# EAGLE design TicTocTrac_bottom_v1.0 (EAGLE 6.1)
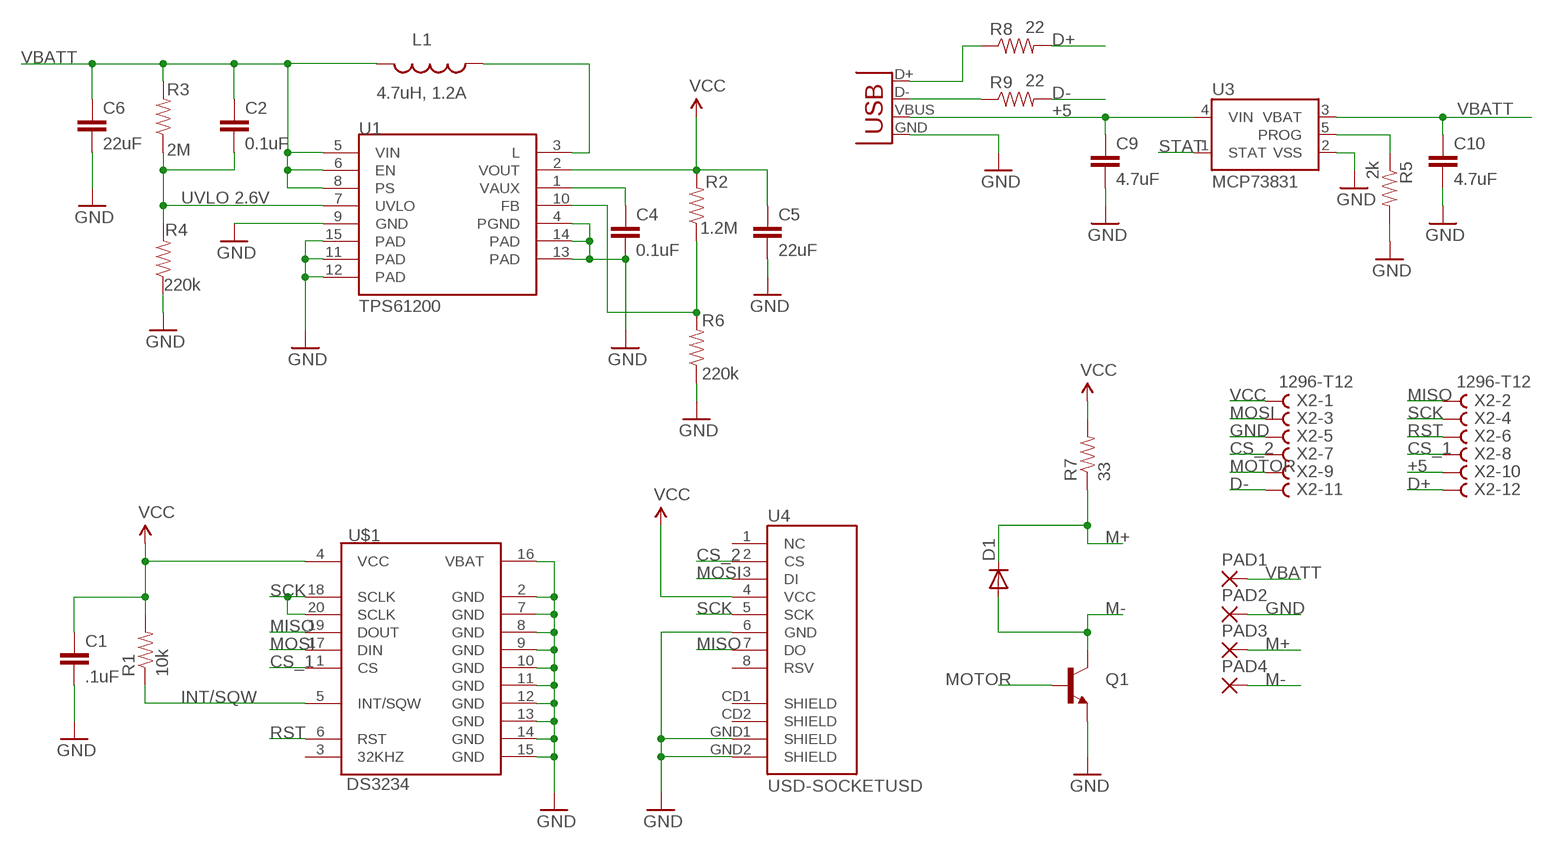
[diagram p0: schematic, sheet 1]

## Parts
C1  .1uF  CAP0402-CAP  [0402-CAP]
C2  0.1uF  CAP0402-CAP  [0402-CAP]
C4  0.1uF  CAP0402-CAP  [0402-CAP]
C5  22uF  CAP0805  [0805]
C6  22uF  CAP0805  [0805]
C9  4.7uF  CAP0402-CAP  [0402-CAP]
C10  4.7uF  CAP0402-CAP  [0402-CAP]
D1  DIODESOD  [SOD-323]
L1  4.7uH, 1.2A  INDUCTOR.  [CDRH2D09]
PAD1  1,6/0,8  [1,6/0,8]
PAD2  1,6/0,8  [1,6/0,8]
PAD3  1,6/0,8  [1,6/0,8]
PAD4  1,6/0,8  [1,6/0,8]
Q1  TRANSISTOR_NPNSOT23  [SOT23]
R1  10k  RESISTOR0402-RES  [0402-RES]
R2  1.2M  RESISTOR0402-RES  [0402-RES]
R3  2M  RESISTOR0402-RES  [0402-RES]
R4  220k  RESISTOR0402-RES  [0402-RES]
R5  2k  RESISTOR0402-RES  [0402-RES]
R6  220k  RESISTOR0402-RES  [0402-RES]
R7  33  RESISTOR0805-RES  [0805]
R8  22  RESISTOR0402-RES  [0402-RES]
R9  22  RESISTOR0402-RES  [0402-RES]
U1  TPS61200  [QFN-10_PAD]
U3  MCP73831  [SOT23-5]
U4  USD-SOCKETUSD  [USD-SOCKET-PP]
U$1  DS3234  [DS3234]
X1  USB-MICROB  [USB-MICROB]
X2  1296-T12  [1296-12]

## Nets
3.3V: R2.1 R6.2 U1.10(FB)
+5: C9.1 U3.4(VIN) X1.VBUS X2.10
CS_1: U$1.1(CS) X2.8
CS_2: U4.2(CS) X2.7
D+: R8.2 X2.12
D-: R9.2 X2.11
GND: C1.2 C4.2 C5.2 C6.2 C9.2 C10.2 PAD2.1(P) Q1.2(E) R4.1 R5.2 R6.1 U1.4(PGND) U1.11(PAD) U1.12(PAD) U1.13(PAD) U1.14(PAD) U1.15(PAD) U3.2(VSS) U4.6(GND) U4.GND1(SHIELD) U4.GND2(SHIELD) U$1.2(GND) U$1.7(GND) U$1.8(GND) U$1.9(GND) U$1.10(GND) U$1.11(GND) U$1.12(GND) U$1.13(GND) U$1.14(GND) U$1.15(GND) U$1.16(VBAT) X1.GND X2.5
INT/SQW: R1.1 U$1.5(INT/SQW)
M+: D1.1(C) PAD3.1(P) R7.1
M-: D1.2(A) PAD4.1(P) Q1.3(C)
MISO: U4.7(DO) U$1.19(DOUT) X2.2
MOSI: U4.3(DI) U$1.17(DIN) X2.3
MOTOR: Q1.1(B) X2.9
N$1: C4.1 U1.1(VAUX)
N$2: L1.P$1 U1.3(L)
N$7: R9.1 X1.D-
N$9: R8.1 X1.D+
N$11: R5.1 U3.5(PROG)
RST: U$1.6(RST) X2.6
SCK: U4.5(SCK) U$1.18(SCLK) U$1.20(SCLK) X2.4
STAT: U3.1(STAT)
UVLO: C2.2 R3.1 R4.2 U1.7(UVLO)
VBATT: C2.1 C6.1 C10.1 L1.P$2 PAD1.1(P) R3.2 U1.5(VIN) U1.6(EN) U1.8(PS) U3.3(VBAT)
VCC: C1.1 C5.1 R1.2 R2.2 R7.2 U1.2(VOUT) U4.4(VCC) U$1.4(VCC) X2.1
Unconnected: U1.9(GND) U4.1(NC) U4.8(RSV) U4.CD1(SHIELD) U4.CD2(SHIELD) U$1.3(32KHZ)

## Notes on the sheet
- UVLO 2.6V

## Library data of the parts
C1 C2 C4 C5 C9 C10 = SparkFun:CAP: Capacitor Standard 0603 ceramic capacitor, and 0.1" leaded capacitor.
C6 = SparkFun-Passives:CAP: Capacitor Standard 0603 ceramic capacitor, and 0.1" leaded capacitor.
D1 = SparkFun:DIODE: Diode These are standard reverse protection diodes and small signal diodes. SMA package can handle up to about 1A. SOD-323 can handle about 200mA. What the SOD-323 package when ordering, there are some mfgs out there that are 5-pin packages.
L1 = SparkFun:INDUCTOR: Inductors Basic Inductor/Choke - 0603 and 1206. Footprints are not proven and vary greatly between part numbers.
PAD1-PAD4 = wirepad:1,6/0,8: THROUGH-HOLE PAD
Q1 = SparkFun:TRANSISTOR_NPN: Transistor NPN BJT configuration in SOT23 package. MMBT2222 is the common NPN we use. Double check BCE configuration again layout.
R1-R9 = SparkFun:RESISTOR: Resistor Basic schematic elements and footprints for 0603, 1206, and PTH resistors.
U1 = SparkFun:TPS61200: DC to DC Booster
U3 = SparkFun:MCP73831: Microchip's MCP73831 Miniature single cell, fully integrated Li-Ion, Li-polymer charge management controller http://ww1.microchip.com/downloads/en/DeviceDoc/21984a.pdf
U4 = tictoc:USD-SOCKET: microSD Socket Push-push type uSD socket. Schematic element and footprint production proven. Spark Fun Electronics SKU : PRT-00127.
U$1 = SparkFun:DS3234: DS3234 Real Time Clock
X1 = SparkFun:USB: USB Connectors USB-B-PTH is fully proven SKU : PRT-00139 USB-miniB is fully proven SKU : PRT-00587 USB-A-PCB is untested. USB-A-H is throughly reviewed, but untested. Spark Fun Electronics SKU : PRT-00437 USB-B-SMT is throughly reviewed, but untested. Needs silkscreen touching up. USB-A-S has not been used/tested USB-MB-H has not been used/tested
X2 = con-leotronics:1296-T12: 1.27mm SINGLE ROW FEMALE SOCKET Source: http://www.leotronics.co.uk/Conexcon/Data%20Sheets/sec.%20A/1296ing.pdf; OC_FARNELL: unknown; OC_NEWARK: unknown

## Board
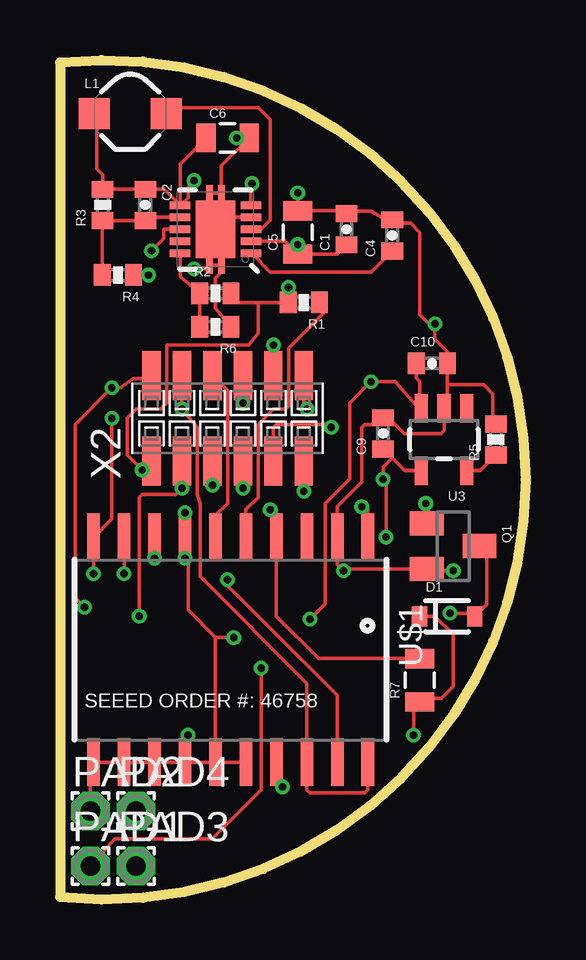
[diagram p1: board, top side]
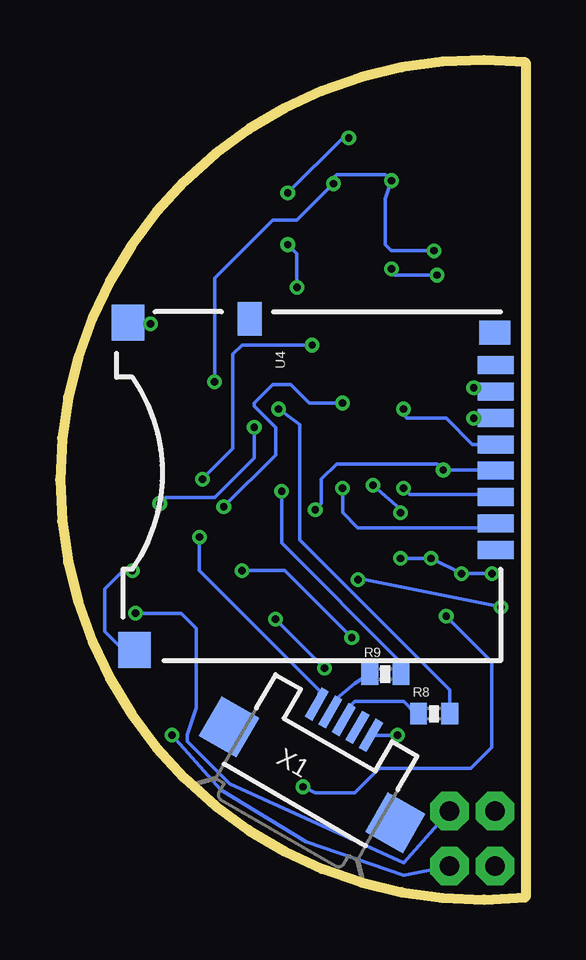
[diagram p2: board, bottom side, seen from below]

Size 19.4 x 35 mm. Coordinates in mm from the lower left corner, seen from the top.
Outline: 0,34.9 0,0.1 arc192 0,34.9
Copper layers (1*16): Top 0.035mm / dielectric 1.5mm / Bottom 0.035mm
Design rules: minimum track width 6mil, minimum drill 12mil, track to track 6mil, track to pad 6mil, pad to pad 6mil, via to via 6mil, smd to smd 0mil, copper to edge 10mil, drill to drill 10mil, minimum pad ring 10mil, minimum via ring 6mil, stop-mask expansion 2mil, vias tented up to drill 100mil, thermal gap 10mil

### Footprints (pad centres in the part's own frame; a part is rotated, then mirrored left to right if it is on the bottom)
0402-CAP = smd 0.7 x 0.9: 1 -0.65,0; 2 0.65,0
0805 = smd 0.8 x 1.2: 1 -0.9,0; 2 0.9,0
SOD-323 = smd 0.63 x 0.83: 1 -1.15,0; 2 1.15,0
CDRH2D09 = smd 1.3 x 1.3: P$1 -1.5,0; P$2 1.5,0
1,6/0,8 = drill 0.813 pad 1.6 octagon: 1 0,0
SOT23 = smd 1 x 1.4: 1 -0.95,-1.1; 2 0.95,-1.1; 3 0,1.1
0402-RES = smd 0.7 x 0.9: 1 -0.65,0; 2 0.65,0
QFN-10_PAD = smd 0.297 x 0.85: 1 -1,-1.475; 2 -0.5,-1.475; 3 0,-1.475; 4 0.5,-1.475; 5 1,-1.475; 6 1,1.475; 7 0.5,1.475; 8 0,1.475; 9 -0.5,1.475; 10 -1,1.475 | smd 0.7 x 0.28: 11 -1.5,0.25; 12 -1.5,-0.25; 13 1.5,0.25; 14 1.5,-0.25 | smd 2.4 x 1.65: 15 0,0
SOT23-5 = smd 0.55 x 1.2: 1 -0.95,-1.3; 2 0,-1.3; 3 0.95,-1.3; 4 0.95,1.3; 5 -0.95,1.3
USD-SOCKET-PP = smd 0.75 x 1.5: 1 3.2,7.91; 2 2.1,7.91; 3 1,7.91; 4 -0.1,7.91; 5 -1.2,7.91; 6 -2.3,7.91; 7 -3.4,7.91; 8 -4.5,7.91 | smd 1 x 1.3: CD1 -5.85,7.86 | smd 1.4 x 1: CD2 -6.425,-2.35 | smd 1.5 x 1.35: GND1 -6.275,-7.415; GND2 7.375,-7.145
DS3234 = smd 0.53 x 1.98: 1 -5.715,-4.685; 2 -4.445,-4.685; 3 -3.175,-4.685; 4 -1.905,-4.685; 5 -0.635,-4.685; 6 0.635,-4.685; 7 1.905,-4.685; 8 3.175,-4.685; 9 4.445,-4.685; 10 5.715,-4.685; 11 5.715,4.685; 12 4.445,4.685; 13 3.175,4.685; 14 1.905,4.685; 15 0.635,4.685; 16 -0.635,4.685; 17 -1.905,4.685; 18 -3.175,4.685; 19 -4.445,4.685; 20 -5.715,4.685
USB-MICROB = smd 0.35 x 1.4: D+ 0,2.65; D- -0.65,2.65; GND 1.3,2.65; ID 0.65,2.65; VBUS -1.3,2.65 | smd 1.8 x 1.9: MT1 -4,0; MT2 4,0
1296-12 = smd 0.76 x 2.05: 1 -3.175,-1.78; 2 -3.175,1.78; 3 -1.905,-1.78; 4 -1.905,1.78; 5 -0.635,-1.78; 6 -0.635,1.78; 7 0.635,-1.78; 8 0.635,1.78; 9 1.905,-1.78; 10 1.905,1.78; 11 3.175,-1.78; 12 3.175,1.78

### Placement (x,y rotation side)
C1  11.94,27.94 90 top
C2  3.56,28.96 270 top
C4  13.84,27.69 90 top
C5  9.91,27.81 90 top
C6  6.98,31.75 0 top
C9  13.46,19.43 90 top
C10  15.49,22.35 0 top
D1  16.13,11.81 0 top
L1  2.92,32.77 180 top
PAD1  1.27,1.4 0 top
PAD2  1.27,3.68 0 top
PAD3  3.18,1.4 0 top
PAD4  3.18,3.68 0 top
Q1  16.38,14.73 270 top
R1  10.16,24.89 180 top
R2  6.48,25.27 0 top
R3  1.78,28.96 90 top
R4  2.41,26.04 180 top
R5  18.16,19.18 90 top
R6  6.48,23.88 180 top
R7  14.99,9.14 90 top
R8  3.81,7.75 0 bottom
R9  5.84,9.4 0 bottom
U1  6.48,27.94 90 top
U3  16,19.18 180 top
U4  9.14,17.78 270 bottom
U$1  7.11,10.41 180 top
X1  8.89,5.21 330 bottom
X2  6.98,20.07 0 top

### Tracks (layer width: path | path; a pad name or v marks a point on that pad's centre or on a via)
3.3V
  Top 0.152: R6.2 R2.1 5,25.97 U1.10
+5  (via drill 0.3)
  Top 0.152: U3.4 14.37,17.88 13.84,18.41 | 13.84,18.41 C9.1 | X2.10 v8.89,23.11 | 13.84,18.41 13.46,18.03 v13.46,17.53 13.59,17.4 v13.59,15.11
  Bottom 0.152: v8.89,23.11 11.81,23.11 12.19,22.73 12.19,18.8 v13.46,17.53 | X1.VBUS 8.56,8.69 13.59,13.72 v13.59,15.11
CS_1  (via drill 0.3)
  Top 0.152: X2.8 v7.62,20.7 | v12.57,16.38 12.7,16.38 12.83,16.26 U$1.1
  Bottom 0.152: v7.62,20.7 9.02,20.7 9.78,21.46 10.54,21.46 11.3,20.7 11.3,20.57 10.41,19.69 10.41,18.54 v12.57,16.38
CS_2  (via drill 0.3)
  Top 0.152: X2.7 v7.62,17.15
  Bottom 0.152: v7.62,17.15 7.62,16.13 6.98,15.49 1.43,15.49 U4.2
D+  (via drill 0.3)
  Top 0.152: v10.29,20.45 10.16,20.57 X2.12
  Bottom 0.152: R8.2 3.16,8.75 9.4,14.99 9.4,19.81 v10.29,20.45
D-  (via drill 0.3)
  Top 0.152: v10.16,17.02 X2.11
  Bottom 0.152: R9.2 5.19,9.89 10.16,14.86 v10.16,17.02
GND  (via drill 0.3)
  Top 0.152: C1.2 12.1,28.7 12.95,28.7 13.57,28.34 C4.2 13.98,28.19 14.61,28.19 14.99,27.81 14.99,24.38 15.37,24 v15.62,24 15.62,23.37 16.14,22.85 C10.2 16.14,21.46 | 16.14,21.46 16.14,20.62 U3.2 16,19.56 15.88,19.43 14.35,19.43 13.7,20.08 C9.2 13.21,19.81 12.7,19.81 12.57,19.69 12.57,17.4 11.56,16.38 U$1.2 11.56,13.97 11.75,13.78 | R5.2 18.03,19.95 18.03,21.08 17.65,21.46 16.14,21.46 | 11.75,13.78 Q1.2 15.35,13.72 v16.38,13.72 | U$1.16 U$1.15 | U$1.15 U$1.14 | U$1.14 U$1.13 U$1.12 U$1.11 1.27,5.73 PAD2.1 | v2.16,20.07 2.16,15.86 U$1.10 v1.4,13.59 | R4.1 v3.68,26.04 | v5.59,26.29 6.08,26.29 U1.11 | U$1.15 6.48,10.92 | U$1.7 5.33,14.97 5.33,12.07 6.48,10.92 | U1.14 U1.13 | U1.4 6.98,28.44 | 6.98,28.44 U1.15 6.48,27.56 6.22,27.31 U1.11 | 6.98,28.44 6.98,28.58 6.73,28.83 U1.14 | U1.11 U1.12 6.73,26.16 6.48,25.91 6.48,24.65 R6.1 | U$1.7 v5.21,16.13 | v6.35,17.27 6.48,18.16 X2.5 | 11.75,13.78 v11.81,13.72 | v7.24,10.92 6.48,10.92 | v5.33,6.86 5.21,6.86 U$1.14 | v2.67,13.59 U$1.9 2.67,15.11 | U$1.8 v3.94,14.22 | U$1.7 v5.21,14.22 | C1.2 | U1.14 6.73,30.59 C6.2 7.49,31.75 7.37,31.88 v7.37,31.75 | v9.91,29.46 C5.2 11.94,28.71 C1.2
  Bottom 0.152: U4.GND1 15.67,24.06 v15.62,24 | U4.6 2.14,20.08 v2.16,20.07 | v3.68,26.04 5.46,26.04 v5.59,26.29 | U4.GND2 16.37,10.41 16.38,10.41 16.76,10.41 17.53,11.18 17.53,12.95 16.76,13.72 v16.38,13.72 | v11.81,13.72 10.03,13.72 v7.24,10.92 | X1.GND v5.34,6.85 v5.33,6.86 | v1.4,13.59 v2.67,13.59 v3.94,14.22 v5.21,14.22 | v5.21,16.13 5.21,16.26 v6.35,17.27 | v9.91,29.46 7.62,31.75 v7.37,31.75
INT/SQW
  Top 0.152: R1.1 11.01,24.47 9.52,22.99 9.52,20.57 9.4,20.45 8.89,20.45 8.25,19.81 8.25,16.76 7.75,16.26 U$1.5
M+  (via drill 0.3)
  Top 0.152: D1.1 15.62,11.81 16.38,11.05 16.38,8.89 15.88,8.38 15.22,8.38 R7.1 14.73,7.99 v14.73,6.86
  Bottom 0.152: PAD3.1 5.08,1.02 9.14,2.41 12.7,4.57 v14.73,6.86
M-  (via drill 0.3)
  Top 0.152: Q1.3 17.78,14.44 17.78,12.31 D1.2 17.15,11.94 v16.26,11.94
  Bottom 0.152: v16.26,11.94 14.35,11.94 13.72,11.3 13.72,8 14.1,6.86 14.1,6.6 12.32,4.83 5.08,1.52 PAD4.1
MISO  (via drill 0.3)
  Top 0.152: X2.2 3.68,21.72 3.05,21.72 2.54,21.34 v2.16,21.34 0.64,19.81 0.64,12.57 v1.02,12.19 | U$1.19 11.56,8.51 6.98,13.08 v6.98,13.34
  Bottom 0.152: U4.7 2.13,21.18 v2.16,21.34 | v6.98,13.34 6.73,13.34 v1.02,12.19
MOSI  (via drill 0.3)
  Top 0.152: X2.3 v5.08,17.15 4.83,16.89 3.43,16.89 3.3,16.76 v3.3,11.81 | U$1.17 v9.27,4.7
  Bottom 0.152: v5.08,17.15 4.83,16.89 1.34,16.89 U4.3 | v9.27,4.7 8.76,4.45 7.11,4.45 6.1,5.46 2.29,5.46 1.4,6.35 1.4,9.91 v3.3,11.81
MOTOR  (via drill 0.3)
  Top 0.152: X2.9 8.89,19.69 9.02,19.81 11.18,19.81 v11.3,19.69 | v15.24,16.51 15.37,16.38 15.37,15.77 Q1.1
  Bottom 0.152: v11.3,19.69 11.3,18.42 12.95,16.76 14.99,16.76 v15.24,16.51
N$1
  Top 0.152: C4.1 12.97,26.16 8.76,26.16 7.98,26.94 U1.1
N$2
  Top 0.152: L1.P$1 4.45,32.77 4.45,33.02 8.25,33.02 8.76,32.51 8.76,28.32 8.38,27.94 U1.3
N$7
  Bottom 0.152: X1.D- 7.87,8.08 7.87,8.38 7.11,9.02 R9.1
N$9
  Bottom 0.152: X1.D+ 7.37,7.7 7.37,8 7.11,8.26 5.08,8.26 4.57,7.75 R8.1
N$11
  Top 0.152: R5.1 17.51,17.88 U3.5
RST
  Top 0.152: U$1.6 6.48,16 6.98,16.51 6.98,21.21 X2.6
SCK  (via drill 0.3)
  Top 0.152: X2.4 v5.08,20.45 5.71,19.69 5.71,16.89 5.84,16.51 5.84,13.46 10.29,9.02 U$1.18 10.29,4.57 10.41,4.45 12.7,4.45 12.83,4.57 U$1.20
  Bottom 0.152: U4.5 2.22,18.98 3.3,20.07 4.95,20.07 5.08,20.19 v5.08,20.45
UVLO
  Top 0.152: U1.7 3.69,28.44 C2.2 R3.1 1.76,28.29 R4.2
VBATT  (via drill 0.3)
  Top 0.152: C6.1 5,30.67 U1.6 | L1.P$2 1.52,32.66 1.52,30.48 1.78,30.23 R3.2 C2.1 4.34,29.61 U1.6 | C10.1 14.84,21.73 14.99,21.59 14.99,20.54 U3.3 14.96,20.48 13.97,21.59 v12.95,21.59 12.07,20.7 12.07,17.53 11.05,16.51 11.05,12.32 v10.41,11.68 | U1.6 5.19,28.94 5.21,28.96 | U1.8 4.32,27.94 4.32,27.56 v3.81,27.05 | v5.59,29.97 5.33,29.72 5.33,29.27 U1.6 | U1.5 7.95,29.8 v8,29.85 | PAD1.1 2.29,2.54 6.35,2.54 8.38,4.57 v8.38,9.65
  Bottom 0.152: 3.68,27.05 v3.81,27.05 5.59,27.05 5.84,27.31 5.84,29.21 v5.59,29.97 5.84,30.23 7.87,30.23 8,30.1 v8,29.85 9.52,28.32 10.54,28.32 12.95,25.91 v12.95,21.59 | v10.41,11.68 v8.38,9.65
VCC  (via drill 0.3)
  Top 0.152: X2.1 v3.43,17.91 2.79,18.54 2.79,20.07 3.18,20.45 4.19,20.45 4.45,20.7 4.45,23.11 7.87,23.11 8.25,23.62 8.25,24.89 | 8.25,24.89 R1.2 9.51,25.42 9.4,25.53 v9.52,25.53 | 8.25,24.89 7.38,24.89 R2.2 | v8.76,16.26 9.02,16 U$1.4 9.02,11.81 10.78,10.04 R7.2 | C1.1 11.56,26.91 C5.1 | U1.2 9.38,27.44 9.39,27.43 9.4,27.43 C5.1 | C5.1 v9.91,27.31
  Bottom 0.152: U4.4 1.26,17.91 v3.43,17.91 3.68,18.16 7.87,18.16 8.51,17.53 8.51,16.51 v8.76,16.26 | v9.91,27.31 9.52,26.92 v9.52,25.53

### Text on the board
tPlace: SEEED ORDER #: 46758